# EasyEDA Pro project ProPrj_辉光管时钟V1.0_2025-10-09.epro, board PCB3
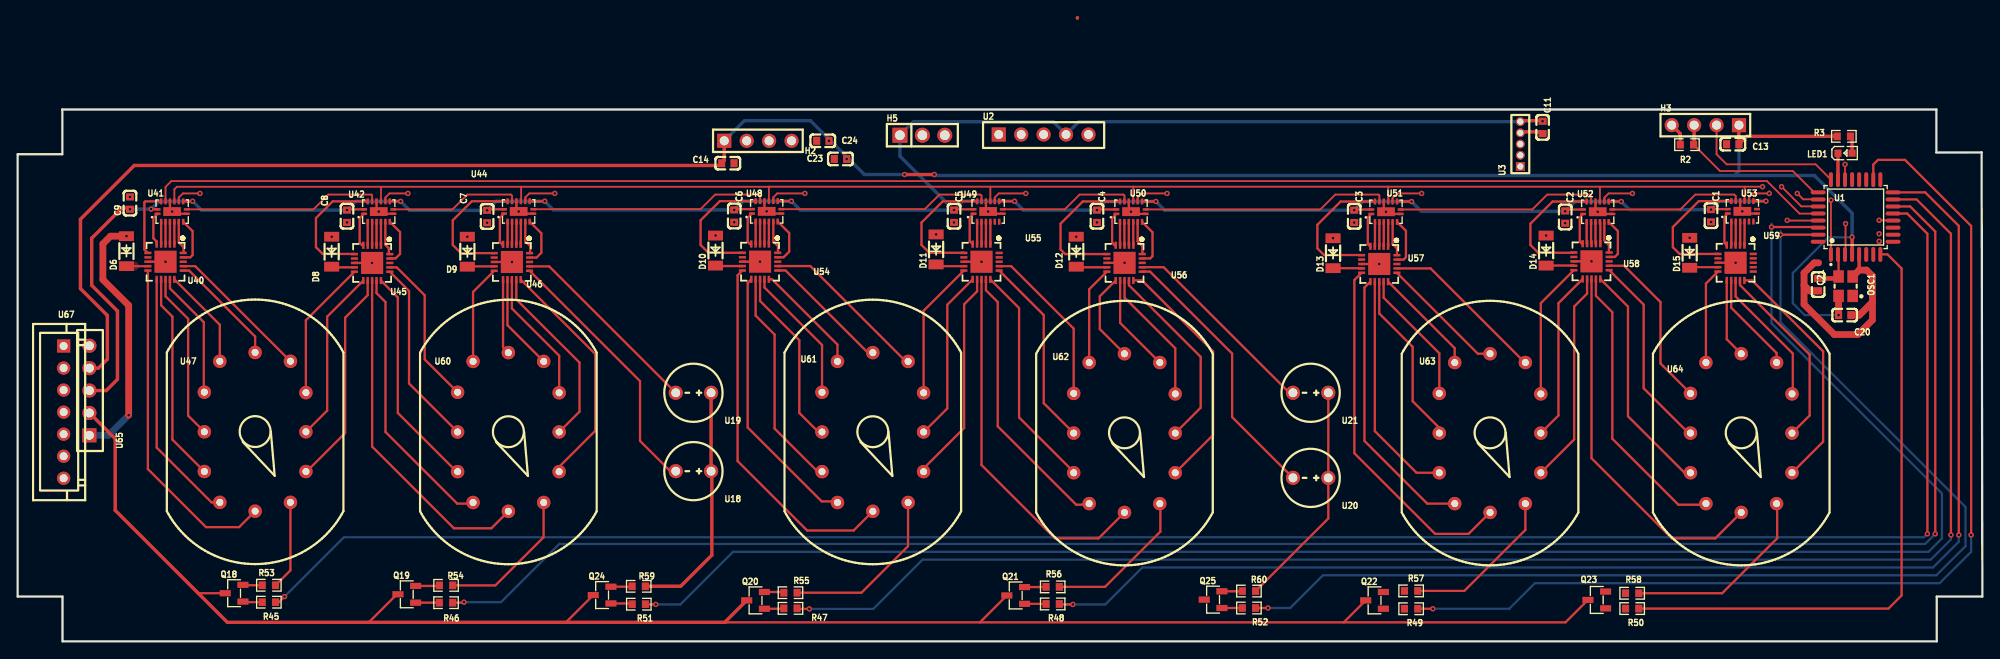
[diagram p10: board, top side]
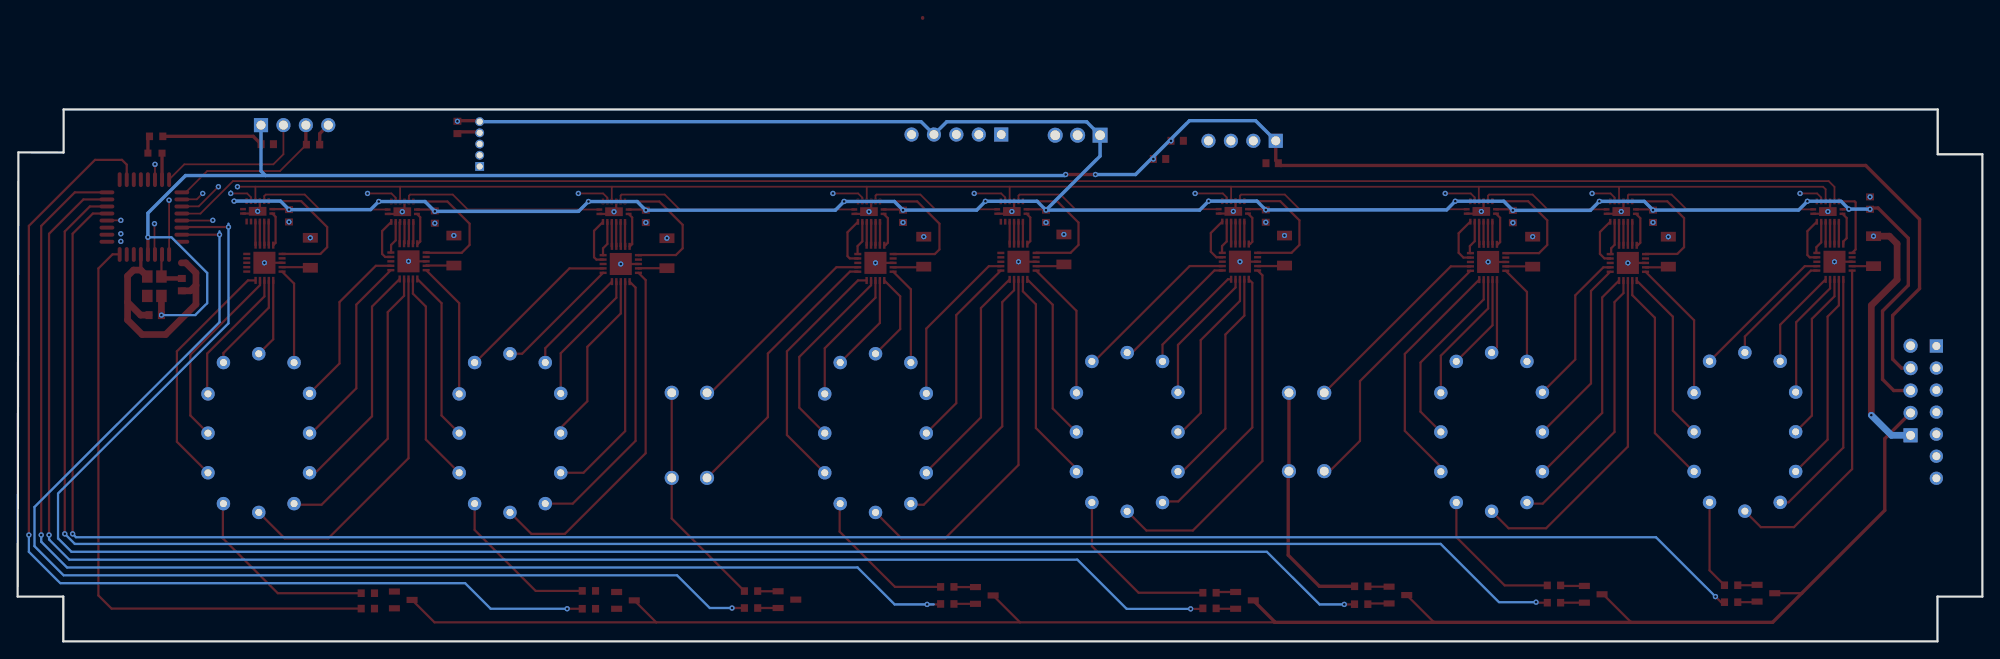
[diagram p11: board, bottom side, seen from below]

Outline 222.5 x 60.33 mm; copper layers: Top Layer, Inner1, Inner2, Bottom Layer. Coordinates in mm from the lower left corner of the outline.
Outline path: 0,55.25 0,5.08 5.08,5.08 5.08,0 217.34,0 217.34,5.08 222.5,5.08 222.42,55.45 217.3,55.44 217.3,60.33 5.05,60.33 5.05,55.25 0,55.25
Stack: Top Layer 0.035mm 外层铜厚1oz / Dielectric1 0.2104mm 7628 RC49% 8.6mil / Inner1 0.0152mm 内层铜厚 / Dielectric2 1.065mm 1.1mm H/HOZ 含铜 / Inner2 0.0152mm 内层铜厚 / Dielectric3 0.2104mm 7628 RC49% 8.6mil / Bottom Layer 0.035mm 外层铜厚1oz

## Design rules (mm)
template: JLCPCB Capability(Two Layers Board)
spacing copperThickness1oz (default): track to track 0.102, other pairs 0.152 to 0.3
spacing copperThickness2oz: track to track 0.203, other pairs 0.152 to 0.3
track width copperThickness1oz (default): min 0.127, default 0.254, max 2.54
track width copperThickness2oz: min 0.203, default 0.254, max 2.54
differential pair differentialPair (default): width min 0.127, default 0.254, max 2.54; gap min 0.152, default 0.152
via viaSize (default): diameter min 0.5, default 0.61, max 10; hole min 0.3, default 0.305, max 6.3

## Placement (name value [footprint] x y rotation side)
C1  100nF  [C0603]  191.78 48.27 270 top
C2  100nF  [C0603]  175.26 48.12 270 top
C3  100nF  [C0603]  151.37 48.2 270 top
C4  100nF  [C0603]  122.23 48.21 270 top
C5  100nF  [C0603]  106.04 48.21 270 top
C6  100nF  [C0603]  81.15 48.23 270 top
C7  100nF  [C0603]  53.17 48.18 270 top
C8  100nF  [C0603]  37.29 48.21 270 top
C9  100nF  [C0603]  12.72 49.71 90 top
C11  100nF  [C0603]  172.7 58.28 270 top
C13  100nF  [C0603]  194.24 56.39 180 top
C14  100nF  [C0603]  80.43 54.23 0 top
C20  100nF  [C0603]  206.92 37 0 top
C21  15pF  [C0603]  203.91 40.46 270 top
C23  100nF  [C0603]  93.18 54.71 0 top
C24  2.2nF  [C0603]  91.19 56.77 0 top
D6  ZMM51  [LL-34_L3.5-W1.5-RD]  12.32 44.25 90 top
D8  ZMM51  [LL-34_L3.5-W1.5-RD]  35.56 44.2 90 top
D9  ZMM51  [LL-34_L3.5-W1.5-RD]  50.93 44.2 90 top
D10  ZMM51  [LL-34_L3.5-W1.5-RD]  79.03 44.32 90 top
D11  ZMM51  [LL-34_L3.5-W1.5-RD]  104.01 44.45 90 top
D12  ZMM51  [LL-34_L3.5-W1.5-RD]  119.89 44.2 90 top
D13  ZMM51  [LL-34_L3.5-W1.5-RD]  148.97 44.02 90 top
D14  ZMM51  [LL-34_L3.5-W1.5-RD]  173.1 44.32 90 top
D15  ZMM51  [LL-34_L3.5-W1.5-RD]  189.36 44.07 90 top
H2  排针  [SIP-2.54MM-4P-CJT-H8.54]  83.83 56.77 180 top
H3  排针  [SIP-2.54MM-4P-CJT-H8.54]  191.13 58.55 0 top
H5  PZ254V-11-03P  [HDR-TH_3P-P2.54-V-M]  102.46 57.4 0 top
LED1  NCD0603R1  [LED0603-RD_RED]  206.95 55.37 0 top
OSC1  8MHz  [OSC-SMD_4P-L3.2-W2.5-BL-1]  207.02 40.28 90 top
Q18  13001  [SOT-23-3_L2.9-W1.3-P1.90-LS2.4-BR]  24.51 5.46 0 top
Q19  13001  [SOT-23-3_L2.9-W1.3-P1.90-LS2.4-BR]  44.07 5.34 0 top
Q20  13001  [SOT-23-3_L2.9-W1.3-P1.90-LS2.4-BR]  83.57 4.65 0 top
Q21  13001  [SOT-23-3_L2.9-W1.3-P1.90-LS2.4-BR]  113.03 5.21 0 top
Q22  13001  [SOT-23-3_L2.9-W1.3-P1.90-LS2.4-BR]  153.67 4.65 0 top
Q23  13001  [SOT-23-3_L2.9-W1.3-P1.90-LS2.4-BR]  178.84 4.7 0 top
Q24  13001  [SOT-23-3_L2.9-W1.3-P1.90-LS2.4-BR]  66.19 5.25 0 top
Q25  13001  [SOT-23-3_L2.9-W1.3-P1.90-LS2.4-BR]  135.38 4.73 0 top
R2  10kΩ  [r0603]  189.05 56.33 0 top
R3  220Ω  [r0603]  206.82 57.28 0 top
R45  10K  [R0603]  28.45 4.45 180 top
R46  10K  [R0603]  48.51 4.38 180 top
R47  10K  [R0603]  87.52 3.74 180 top
R48  10K  [R0603]  117.22 4.24 180 top
R49  10K  [R0603]  157.81 3.7 180 top
R50  10K  [R0603]  182.85 3.72 180 top
R51  10K  [R0603]  70.35 4.22 180 top
R52  10K  [R0603]  139.45 3.78 180 top
R53  20K  [R0603]  28.45 6.37 180 top
R54  20K  [R0603]  48.51 6.35 180 top
R55  20K  [R0603]  87.52 5.52 180 top
R56  20K  [R0603]  117.22 6.18 180 top
R57  20K  [R0603]  157.81 5.72 180 top
R58  20K  [R0603]  182.85 5.46 180 top
R59  100K  [R0603]  70.34 6.25 180 top
R60  100K  [R0603]  139.45 5.71 180 top
U1  STM32G070KBT6  [LQFP-32_L7.0-W7.0-P0.80-LS9.0-BL]  208.15 48.12 0 top
U2  -  [2.54mm1*5]  116.19 57.48 0 top
U3  FH1.27-01-5PZD  [HDR-TH_5P-P1.27-V-M]  170.18 56.4 90 top
U18  -  [6*13氖泡]  76.53 19.3 180 top
U19  -  [6*13氖泡]  76.53 28.19 180 top
U20  -  [6*13氖泡]  146.43 18.54 180 top
U21  -  [6*13氖泡]  146.43 28.19 180 top
U40  ULN2803A  [QFN-20_L4.0-W4.0-P0.50-BL-EP]  16.75 43.05 180 top
U41  74HC595BQ,115  [DHVQFN-16_L3.5-W2.5-P0.50-BL-EP]  17.5 48.74 0 top
U42  74HC595BQ,115  [DHVQFN-16_L3.5-W2.5-P0.50-BL-EP]  40.89 48.74 0 top
U44  74HC595BQ,115  [DHVQFN-16_L3.5-W2.5-P0.50-BL-EP]  56.74 48.76 0 top
U45  ULN2803A  [QFN-20_L4.0-W4.0-P0.50-BL-EP]  40.14 42.92 180 top
U46  ULN2803A  [QFN-20_L4.0-W4.0-P0.50-BL-EP]  55.97 43.03 180 top
U47  -  [IN12]  26.89 23.77 0 top
U48  74HC595BQ,115  [DHVQFN-16_L3.5-W2.5-P0.50-BL-EP]  84.83 48.77 0 top
U49  74HC595BQ,115  [DHVQFN-16_L3.5-W2.5-P0.50-BL-EP]  109.91 48.75 0 top
U50  74HC595BQ,115  [DHVQFN-16_L3.5-W2.5-P0.50-BL-EP]  126.09 48.73 0 top
U51  74HC595BQ,115  [DHVQFN-16_L3.5-W2.5-P0.50-BL-EP]  154.97 48.73 0 top
U52  74HC595BQ,115  [DHVQFN-16_L3.5-W2.5-P0.50-BL-EP]  178.94 48.73 0 top
U53  74HC595BQ,115  [DHVQFN-16_L3.5-W2.5-P0.50-BL-EP]  195.33 48.77 0 top
U54  ULN2803A  [QFN-20_L4.0-W4.0-P0.50-BL-EP]  84.08 43.06 180 top
U55  ULN2803A  [QFN-20_L4.0-W4.0-P0.50-BL-EP]  109.16 43.05 180 top
U56  ULN2803A  [QFN-20_L4.0-W4.0-P0.50-BL-EP]  125.36 42.93 180 top
U57  ULN2803A  [QFN-20_L4.0-W4.0-P0.50-BL-EP]  154.2 42.8 180 top
U58  ULN2803A  [QFN-20_L4.0-W4.0-P0.50-BL-EP]  178.24 43.1 180 top
U59  ULN2803A  [QFN-20_L4.0-W4.0-P0.50-BL-EP]  194.56 42.94 180 top
U60  -  [IN12]  55.58 23.75 0 top
U61  -  [IN12]  96.85 23.75 0 top
U62  -  [IN12]  125.35 23.62 0 top
U63  -  [IN12]  166.75 23.62 0 top
U64  -  [IN12]  195.2 23.62 0 top
U65  -  [2.54mm1*5]  8.13 28.45 90 top
U67  HX 2.54mm-7P ZZ  [CONN-TH_7P-P2.50_HX-2.54MM-7P-ZZ]  5.21 26 270 top

## Footprints (pads in the part's own frame, mm; a bottom-side part is the same pattern mirrored in y, then rotated)
2.54mm1*5
  rect 1.6x1.6 hole 1: 1(-5.08,0)
  round 1.6 hole 1: 2(-2.54,0) 3(0,0) 4(2.54,0) 5(5.08,0)
6*13氖泡
  round 1.6 hole 1: 1(-2,0) 2(2,0)
C0603
  rect 0.8x0.9 smd: 1(-0.7,0) 2(0.7,0)
CONN-TH_7P-P2.50_HX-2.54MM-7P-ZZ
  rect 1.5x1.5 hole 0.9: 1(-7.5,0)
  round 1.5 hole 0.9: 2(-5,0) 3(-2.5,0) 4(0,0) 5(2.5,0) 6(5,0) 7(7.5,0)
DHVQFN-16_L3.5-W2.5-P0.50-BL-EP
  rect 0.665x0.28 smd: 1(-1.657,-0.25) 8(1.657,-0.25) 9(1.657,0.25) 16(-1.657,0.25)
  rect 0.28x0.665 smd: 2(-1.25,-1.157) 3(-0.75,-1.157) 4(-0.25,-1.157) 5(0.25,-1.157) 6(0.75,-1.157) 7(1.25,-1.157) 10(1.25,1.157) 11(0.75,1.157) 12(0.25,1.157) 13(-0.25,1.157) 14(-0.75,1.157) 15(-1.25,1.157)
  rect 2x1 smd: 17(0,0)
HDR-TH_3P-P2.54-V-M
  rect 1.7x1.7 hole 1.1: 1(-2.54,0)
  round 1.7 hole 1.1: 2(0,0) 3(2.54,0)
HDR-TH_5P-P1.27-V-M
  rect 1x1 hole 0.7: 1(-2.54,0)
  round 1 hole 0.7: 2(-1.27,0) 3(0,0) 4(1.27,0) 5(2.54,0)
IN12
  round 1.524 hole 0.8: 0(5.75,-4.501) 1(-4,-8.001) 2(-5.75,-4.501) 3(-5.75,0) 4(-5.75,4.501) 5(-4,8.001) 6(0,8.999) 7(4,8.001) 8(5.75,4.445) 9(5.75,0) DOT(0,-8.999) HV(4,-8.001)
LED0603-RD_RED
  rect 0.8x0.8 smd: 1(-0.799,-0.004) 2(0.799,0.004)
LL-34_L3.5-W1.5-RD
  rect 1.1x1.7 smd: 1(-1.7,0) 2(1.7,0)
LQFP-32_L7.0-W7.0-P0.80-LS9.0-BL
  oval 0.448x1.684 smd: 1(-2.8,-4.242) 2(-2,-4.242) 3(-1.2,-4.242) 4(-0.4,-4.242) 5(0.4,-4.242) 6(1.2,-4.242) 7(2,-4.242) 8(2.8,-4.242) 17(2.8,4.242) 18(2,4.242) 19(1.2,4.242) 20(0.4,4.242) 21(-0.4,4.242) 22(-1.2,4.242) 23(-2,4.242) 24(-2.8,4.242)
  oval 1.684x0.448 smd: 9(4.242,-2.8) 10(4.242,-2) 11(4.242,-1.2) 12(4.242,-0.4) 13(4.242,0.4) 14(4.242,1.2) 15(4.242,2) 16(4.242,2.8) 25(-4.242,2.8) 26(-4.242,2) 27(-4.242,1.2) 28(-4.242,0.4) 29(-4.242,-0.4) 30(-4.242,-1.2) 31(-4.242,-2) 32(-4.242,-2.8)
OSC-SMD_4P-L3.2-W2.5-BL-1
  rect 1.4x1.2 smd: 1(-1.1,-0.8) 2(1.1,-0.8) 3(1.1,0.8) 4(-1.1,0.8)
QFN-20_L4.0-W4.0-P0.50-BL-EP
  rect 0.28x0.8 smd: 1(-1,-2) 2(-0.5,-2) 3(0,-2) 4(0.5,-2) 5(1,-2) 11(1,2) 12(0.5,2) 13(0,2) 14(-0.5,2) 15(-1,2)
  rect 0.8x0.28 smd: 6(2,-1) 7(2,-0.5) 8(2,0) 9(2,0.5) 10(2,1) 16(-2,1) 17(-2,0.5) 18(-2,0) 19(-2,-0.5) 20(-2,-1)
  rect 2.5x2.5 smd: 21(0,0)
R0603
  rect 0.806x0.864 smd: 1(-0.753,0) 2(0.753,0)
r0603
  rect 0.806x0.864 smd: 1(-0.753,0) 2(0.753,0)
SIP-2.54MM-4P-CJT-H8.54
  rect 1.6x1.6 hole 1.02: 1(3.81,0)
  round 1.6 hole 1.02: 2(1.27,0) 3(-1.27,0) 4(-3.81,0)
SOT-23-3_L2.9-W1.3-P1.90-LS2.4-BR
  rect 1.25x0.7 smd: 1(1,-0.95) 2(1,0.95) 3(-1,0)

## Nets
As in the schematic.

Pads without a net: OSC1 1; U40 7 18; U45 7 18; U46 7 18; U53 6 7 9; U54 7 18; U55 7 18; U56 7 18; U57 7 18; U58 7 18; U59 7 16 17 18 19 20

## Via types
v1: diameter 0.61, hole 0.305, Top Layer to Bottom Layer, 96 vias

## Routing (per net, layer and track width the routed paths; a pad name or vN(x,y) marks a point on that pad's centre or on a via; arc(x,y) is an arc through that point)
170V: length 208.6
  Top Layer w0.254: 150.18,2.16 108.98,2.16 ; 150.18,2.16 175.3,2.16 Q23.3 ; 150.18,2.16 Q22.3 ; 108.98,2.16 80.16,2.16 ; 108.98,2.16 Q21.3 ; 20.45,5.46 Q18.3 ; Q24.3 62.1,2.16 ; 42.94,5.33 39.77,2.16
  Top Layer w0.381: 8.13,25.91 11.05,22.99 11.05,14.86 23.75,2.16 80.16,2.16 80.16,2.24 Q20.3
+3.3V: length 274.8
  Top Layer w0.381: 194.92,56.13 194.92,58.52 H3.1 ; 207.75,43.89 v1(207.75,45.83) 207.77,45.85 ; U65.4 9.14,30.99 10.16,32 10.16,36.96 7.11,40.01 7.11,47.88 13.21,53.98 79.46,53.98 80.02,54.54 H2.1 ; 194.94,56.39 195.82,57.28 R3.1 ; v1(100.44,52.95) v1(103.82,52.95)
  Top Layer w0.762: v1(206.22,37) OSC1.4
  Bottom Layer w0.254: v1(207.75,45.83) 205.09,45.83 201.04,41.78 201.04,38.35 202.39,37 v1(206.22,37)
  Bottom Layer w0.381: H2.1 82.31,59.06 89.79,59.06 95.9,52.95 v1(100.44,52.95) ; 194.44,52.83 203.49,52.83 207.75,48.57 v1(207.75,45.83) ; 194.44,52.83 194.94,53.34 H3.1 ; 194.44,52.83 103.93,52.83 v1(103.82,52.95)
  vias: v1(91.89,56.77) v1(93.88,54.71)
+5V: length 335.5
  Top Layer w0.254: U51.10 v1(157.86,49.88) ; U42.16 37.38,48.99 v1(37.29,48.91) ; U41.16 15.81,49.02 v1(15.11,49.02) ; v1(191.78,48.97) 191.83,49.02 U53.16 ; v1(106.04,48.91) 106.14,49 U49.16 ; U50.10 v1(128.91,49.89) ; U48.16 81.24,49.02 v1(81.15,48.93) ; U52.16 175.47,48.98 v1(175.26,48.77) ; v1(19.81,49.91) 19.8,49.9 U41.10 ; U51.16 151.44,48.98 v1(151.37,48.9) ; U53.10 v1(197.99,49.93) ; U52.10 v1(181.61,49.88) ; U48.10 v1(87.63,49.93) ; v1(122.23,48.91) 122.31,48.98 U50.16 ; v1(53.17,48.88) 53.29,49.01 U44.16 ; U42.10 v1(43.37,49.9) ; U44.10 v1(59.69,49.92) ; U49.10 v1(112.9,49.91)
  Top Layer w0.381: v1(172.7,58.98) 172.63,59.06 170.18,59.06 ; 120.01,70.74 120.01,70.68 ; v1(12.72,49.01) 12.58,49.15 11.81,49.15 8.38,45.72 8.38,40.39 11.3,37.47 11.3,29.72 10.03,28.45 U65.3
  Bottom Layer w0.381: v1(106.04,48.91) 99.92,55.03 H5.1 ; v1(106.04,48.91) 107.04,49.91 v1(112.9,49.91) 113.9,48.91 v1(122.23,48.91) 123.21,49.89 v1(128.91,49.89) 129.9,48.9 v1(151.37,48.9) 152.35,49.88 v1(157.86,49.88) 158.98,48.77 v1(175.26,48.77) 176.38,49.88 v1(181.61,49.88) 182.53,48.97 v1(191.78,48.97) 192.74,49.93 v1(197.99,49.93) ; v1(106.04,48.91) 88.65,48.91 v1(87.63,49.93) 82.15,49.93 v1(81.15,48.93) 60.67,48.93 v1(59.69,49.92) 54.2,49.92 v1(53.17,48.88) 44.39,48.88 v1(43.37,49.9) 38.28,49.9 v1(37.29,48.91) 20.81,48.91 v1(19.81,49.91) 16,49.91 v1(15.11,49.02) 12.73,49.02 v1(12.72,49.01) ; 170.18,58.94 120.19,58.94 U2.4 117.29,58.93 101.44,58.93 H5.1 ; H5.1 99.92,57.53
GND: length 62.4
  Top Layer w0.254: U49.8 110.16,48.5 v1(109.91,48.75) 109.66,49 U49.13 ; U41.13 17.25,48.99 v1(17.5,48.74) 17.75,48.49 U41.8 ; U42.8 41.14,48.49 v1(40.89,48.74) 40.64,48.99 U42.13 ; U53.8 195.58,48.52 v1(195.33,48.77) 195.08,49.02 U53.13 ; U50.13 125.84,48.98 v1(126.09,48.73) 126.34,48.48 U50.8 ; U52.13 178.69,48.98 v1(178.94,48.73) 179.19,48.48 U52.8 ; U44.13 56.49,49.01 v1(56.74,48.76) 56.99,48.51 U44.8 ; U48.8 85.08,48.52 v1(84.83,48.77) 84.58,49.02 U48.13 ; U51.8 155.22,48.48 v1(154.97,48.73) 154.72,48.98 U51.13
  Top Layer w0.381: 170.18,57.79 172.5,57.79 C11.2 ; H3.4 188.3,57.58 R2.1 ; 208.55,42.11 208.55,43.89
  Top Layer w0.762: 202.31,40.39 202.94,39.76 C21.2 ; 202.31,40.39 202.31,38.23 205.74,34.8 208.41,34.8 210.06,36.45 210.06,38.48 ; 202.31,40.39 202.31,41.78 203.45,42.93 203.96,42.93 ; 210.06,38.48 208.58,37 C20.2 ; 210.06,38.48 210.06,41.43 209.38,42.11 208.55,42.11 OSC1.2
  vias: v1(12.72,50.41) v1(37.29,47.51) v1(53.17,47.48) v1(81.15,47.53) v1(106.04,47.51) v1(122.23,47.51) v1(151.37,47.5) v1(175.26,47.42) v1(191.78,47.57)
170_GND: length 47.1
  Top Layer w0.254: U40.8 v1(16.75,43.05) ; U46.8 v1(55.97,43.03) ; U58.8 v1(178.24,43.1) ; U56.8 U56.21 ; U59.8 v1(194.56,42.94) ; U57.8 v1(154.2,42.8) ; U45.8 v1(40.14,42.92) ; U55.8 v1(109.16,43.05) ; U54.8 v1(84.08,43.06)
  Top Layer w0.762: v1(12.57,25.65) 12.57,38.1 9.65,41.02 9.65,45.09 10.52,45.95 D6.2
  Bottom Layer w0.762: v1(12.57,25.65) 10.29,23.37 U65.1
  vias: v1(12.33,45.96) v1(35.56,45.89) v1(50.93,45.9) v1(79.04,46.03) v1(104.02,46.15) v1(119.89,45.9) v1(125.36,42.94) v1(148.98,45.73) v1(173.11,46.03) v1(189.36,45.77)
A0: length 2.7
  Top Layer w0.254: U42.2 U45.4
A1: length 3.8
  Top Layer w0.254: U41.1 15.37,48.02 15.37,45.72 15.75,45.34 U40.5
A2: length 2.5
  Top Layer w0.254: U41.2 U40.4
A3: length 2.5
  Top Layer w0.254: U41.3 U40.3
A4: length 2.5
  Top Layer w0.254: U41.4 U40.2
A5: length 2.5
  Top Layer w0.254: U41.5 U40.1
A6: length 3.8
  Top Layer w0.254: U41.6 18.25,45.25 18.8,44.7 18.8,44.1 U40.20
A7: length 5.4
  Top Layer w0.254: U41.7 19.81,46.52 19.81,43.82 19.55,43.55 U40.19
A8: length 14.6
  Top Layer w0.254: U42.15 35.68,49.9 33.78,48.01 33.78,44.7 34.54,43.94 38.12,43.94 U45.6
A9: length 4
  Top Layer w0.254: U45.5 39.03,44.92 38.73,45.21 38.73,47.99 U42.1
A_HV: length 10.1
  Top Layer w0.254: 30.89,15.76 30.89,8.06 R53.1
ADOT: length 7.8
  Top Layer w0.254: U41.15 14.46,49.9 14.35,49.79 14.35,44.45 U40.6
B0: length 2.6
  Top Layer w0.254: U44.5 56.99,45.05 U46.1
B1: length 2.7
  Top Layer w0.254: U42.4 U45.2
B2: length 2.7
  Top Layer w0.254: U42.5 U45.1
B3: length 3.9
  Top Layer w0.254: U45.20 42.04,44.03 42.04,44.58 41.64,44.97 U42.6
B4: length 5.5
  Top Layer w0.254: U45.19 42.16,43.43 42.8,43.43 43.31,43.94 43.31,46.42 U42.7
B5: length 15
  Top Layer w0.254: U44.15 51.44,49.92 49.28,47.75 49.28,44.96 50.2,44.03 U46.6
B6: length 3.9
  Top Layer w0.254: U46.5 54.86,45.03 54.61,45.28 54.61,48.04 U44.1
B7: length 2.6
  Top Layer w0.254: U44.2 55.49,45.05 U46.4
B8: length 2.6
  Top Layer w0.254: U46.3 55.99,45.05 U44.3
B9: length 2.6
  Top Layer w0.254: U44.4 56.49,45.05 U46.2
B_HV: length 16.5
  Top Layer w0.254: U60.HV 59.56,15.74 59.56,11.81 54.1,6.35 R54.1
BDOT: length 2.7
  Top Layer w0.254: U42.3 U45.3
C0: length 2.5
  Top Layer w0.254: U49.2 U55.4
C1: length 3.9
  Top Layer w0.254: U54.5 82.93,45.06 82.68,45.32 82.68,48.02 U48.1
C2: length 2.5
  Top Layer w0.254: U48.2 83.58,45.06
C3: length 2.5
  Top Layer w0.254: U48.3 U54.3
C4: length 2.5
  Top Layer w0.254: U48.4 84.58,45.06
C5: length 2.5
  Top Layer w0.254: U48.5 U54.1
C6: length 3.8
  Top Layer w0.254: U48.6 85.58,45.36 86.11,44.83 86.11,44.09 U54.20
C7: length 5.5
  Top Layer w0.254: U54.19 86.08,43.56 86.74,43.56 87.38,44.2 87.38,46.31 U48.7
C8: length 15
  Top Layer w0.254: U55.6 107.14,44.07 103.25,44.07 102.36,44.96 102.36,47.5 104.77,49.91 U49.15
C9: length 3.8
  Top Layer w0.254: U49.1 107.82,48.07 107.82,45.39 U55.5
C_HV: length 19.7
  Top Layer w0.254: R55.1 95.56,5.52 100.84,10.8 100.84,15.74 U61.HV
CDOT: length 15
  Top Layer w0.254: U48.15 79.52,49.93 77.34,47.75 77.34,44.96 78.23,44.07 82.07,44.07 U54.6
CLK: length 217.4
  Top Layer w0.203: U48.11 85.58,50.36 86.02,50.8 v1(89.15,50.8) ; v1(44.2,50.8) 42.11,50.8 41.64,50.34 U42.11 ; U49.11 110.66,50.34 111.12,50.8 v1(114.17,50.8) ; U41.11 18.25,50.34 18.71,50.8 v1(20.65,50.8) ; 203.91,50.14 202.21,50.14 v1(201.55,50.8) ; U51.11 155.72,50.32 156.2,50.8 v1(159,50.8) ; U52.11 179.69,50.32 180.18,50.8 v1(182.88,50.8) ; v1(60.83,50.8) 57.94,50.8 57.49,50.35 U44.11 ; v1(198.37,50.8) 196.51,50.8 196.08,50.36 U53.11 ; v1(130.17,50.8) 127.32,50.8 126.84,50.33 U50.11
  Inner2 w0.203: 60.83,51.05 195.33,51.05 195.58,50.8 v1(198.37,50.8) v1(201.55,50.8) ; v1(20.65,50.8) 20.9,51.05 43.94,51.05 v1(44.2,50.8) 44.45,51.05 60.58,51.05 v1(60.83,50.8)
  Bottom Layer w0.203: 198.37,51.05 v1(198.37,50.8)
COLON1: length 198.9
  Top Layer w0.254: v1(72.26,4.19) 71.13,4.19 R51.1 ; v1(198.63,46.99) 203.84,46.99 U1.30
  Bottom Layer w0.254: 198.63,47.37 v1(198.63,46.99) 198.63,36.07 217.93,16.76 217.93,11.68 216.41,10.16 81.03,10.16 75.06,4.19 v1(72.26,4.19)
COLON2: length 132
  Top Layer w0.254: U1.31 v1(199.64,46.12) ; R52.1 v1(141.6,3.78)
  Bottom Layer w0.254: 199.64,46.5 v1(199.64,46.12) 199.64,36.2 220.6,15.24 220.6,10.8 217.3,7.49 147.83,7.49 144.12,3.78 v1(141.6,3.78)
CS: length 201
  Top Layer w0.203: 155.19,51.56 155.22,51.54 U51.12 ; 155.19,51.56 126.34,51.56 ; 155.19,51.56 179.19,51.56 ; 85.09,51.56 57.02,51.56 ; 85.09,51.56 85.08,51.55 85.08,50.05 ; 85.09,51.56 85.09,51.56 110.16,51.56 ; 57.02,51.56 18.03,51.56 17.75,51.28 17.75,50.03 ; 57.02,51.56 57.02,50.08 56.99,50.04 ; v1(199.77,51.56) 202,49.34 203.91,49.34 ; 195.58,51.56 195.58,49.93 U53.12 ; 195.58,51.56 179.19,51.56 ; 195.58,51.56 v1(197.61,51.56) ; 41.15,51.44 41.14,51.43 U42.12 ; 126.34,51.56 110.16,51.56 ; 126.34,51.56 126.34,50.02 ; 110.16,51.56 110.16,50.04 ; 179.19,51.56 179.19,50.01
  Inner2 w0.203: v1(199.77,51.56) v1(197.61,51.56)
D0: length 2.6
  Top Layer w0.254: 126.36,44.94 126.34,44.95 U50.5
D1: length 2.5
  Top Layer w0.254: U49.4 U55.2
D2: length 2.5
  Top Layer w0.254: U49.5 U55.1
D5: length 16.2
  Top Layer w0.254: U50.15 120.63,49.89 118.11,47.37 118.11,44.45 118.63,43.93 U56.6
D6: length 4
  Top Layer w0.254: U50.1 123.95,48 123.95,45.21 124.23,44.94 124.36,44.94
D7: length 2.6
  Top Layer w0.254: U50.2 124.84,44.95 124.86,44.94
D8: length 2.6
  Top Layer w0.254: 125.36,44.94 125.34,44.95 U50.3
D9: length 2.6
  Top Layer w0.254: 125.86,44.94 125.84,44.95 U50.4
D_HV: length 17.2
  Top Layer w0.254: U62.HV 129.41,15.56 129.41,12.45 123.15,6.18 R56.1
DDOT: length 2.5
  Top Layer w0.254: U49.3 U55.3
DS3231: length 3.5
  Top Layer w0.203: U1.29 200.44,47.72 v1(200.41,47.75)
E0: length 2.5
  Top Layer w0.254: U58.4 177.69,45.15 U52.2
E1: length 4
  Top Layer w0.254: U57.5 153.16,44.8 152.91,45.05 152.91,48.07 U51.1
E2: length 2.8
  Top Layer w0.254: U57.4 153.72,44.82 U51.2
E3: length 2.8
  Top Layer w0.254: U51.3 154.22,44.82 U57.3
E4: length 2.8
  Top Layer w0.254: U51.4 154.72,44.82 U57.2
E5: length 2.8
  Top Layer w0.254: U51.5 155.22,44.82 U57.1
E6: length 4
  Top Layer w0.254: U51.6 155.72,45.07 156.21,44.58 156.21,43.81 U57.20
E7: length 5.6
  Top Layer w0.254: U51.7 157.23,46.56 157.23,43.56 156.96,43.3 U57.19
E8: length 15.1
  Top Layer w0.254: U58.6 176.21,44.07 172.21,44.07 171.32,44.96 171.32,47.37 173.84,49.88 U52.15
E9: length 3.7
  Top Layer w0.254: U58.5 177.16,45.1 176.91,45.35 176.91,48.1 U52.1
E_HV: length 18
  Top Layer w0.254: U63.HV 170.75,12.64 163.84,5.72 R57.1
EDOT: length 15.6
  Top Layer w0.254: U51.15 149.83,49.88 147.19,47.24 147.19,44.58 147.95,43.82 152.19,43.82 U57.6
F0: length 2.7
  Top Layer w0.254: U53.5 195.58,44.96 U59.1
F1: length 2.5
  Top Layer w0.254: U52.4 178.69,45.15 U58.2
F2: length 2.5
  Top Layer w0.254: U52.5 179.24,47.52 U58.1
F3: length 3.7
  Top Layer w0.254: U58.20 180.21,44.13 180.21,44.96 179.69,45.48 U52.6
F4: length 5.2
  Top Layer w0.254: U52.7 181.23,46.53 181.23,43.94 180.89,43.6 U58.19
F5: length 15.6
  Top Layer w0.254: U53.15 190.39,49.93 187.45,46.99 187.45,44.7 188.21,43.94 192.56,43.94 U59.6
F6: length 3.9
  Top Layer w0.254: U59.5 193.55,44.94 193.29,45.19 193.29,48.15 U53.1
F7: length 2.7
  Top Layer w0.254: U59.4 194.08,44.96 U53.2
F8: length 2.7
  Top Layer w0.254: U53.3 194.58,44.96 U59.3
F9: length 2.7
  Top Layer w0.254: U59.2 195.08,44.96 U53.4
F_HV: length 22.2
  Top Layer w0.254: U64.HV 199.26,15.56 199.26,11.68 193.04,5.46 R58.1
FDOT: length 2.5
  Top Layer w0.254: U58.3 178.19,45.15 U52.3
G0: length 3.8
  Top Layer w0.254: U44.6 57.49,45.38 58.04,44.83 58.04,44.1 U46.20
G1: length 5.6
  Top Layer w0.254: U44.7 59.31,46.28 59.31,44.07 58.77,43.53 U46.19
G_HV: length 27.4
  Top Layer w0.381: U19.1 U18.1 78.61,19.22 78.61,9.78 75.08,6.25 R59.1
H0: length 3.9
  Top Layer w0.254: U50.6 126.84,45.37 127.38,44.83 127.38,43.96 127.36,43.94
H1: length 5.7
  Top Layer w0.254: 127.36,43.44 127.36,43.43 128.27,43.43 128.52,43.69 128.52,46.39 U50.7
H_HV: length 25.9
  Top Layer w0.254: R60.1 148.43,13.94 U20.1 U21.1
INFRARED-RAY: length 1.7
  Top Layer w0.203: U1.22 v1(206.95,54.1)
LED: length 3
  Top Layer w0.381: LED1.1 206.15,52.38
MOSI: length 190.6
  Top Layer w0.203: U41.14 16.75,51.55 17.4,52.2 198.12,52.2 201.8,48.51 203.89,48.51 203.91,48.54
NIX_A0: length 24.6
  Top Layer w0.254: U45.12 39.64,39.26 37.08,36.7 37.08,23.62 32.73,19.26 U47.0
NIX_A1: length 28.8
  Top Layer w0.254: U47.1 21.95,15.76 15.75,21.97 U40.11
NIX_A2: length 23.8
  Top Layer w0.254: U40.12 16.25,38.11 17.53,36.83 17.53,22.88 U47.2
NIX_A3: length 19.1
  Top Layer w0.254: U40.13 16.75,39.13 19.3,36.58 19.3,25.6 U47.3
NIX_A4: length 14.4
  Top Layer w0.254: 21.14,28.27 21.08,28.33 21.08,36.2 17.25,40.03 U40.14
NIX_A5: length 11.4
  Top Layer w0.254: 22.89,31.77 22.89,35.91 U40.15
NIX_A6: length 13.1
  Top Layer w0.254: U40.16 19.41,42.05 26.89,34.57 U47.6
NIX_A7: length 16.6
  Top Layer w0.254: U40.17 20.11,42.55 30.89,31.77
NIX_A8: length 16
  Top Layer w0.254: U47.8 32.64,36.42 U45.10
NIX_A9: length 19.8
  Top Layer w0.254: U45.11 35.05,36.83 35.05,26.17 U47.9
NIX_ADOT: length 38.1
  Top Layer w0.254: U40.10 14.75,19.54 21.34,12.95 25.08,12.95 26.89,14.77
NIX_B0: length 27
  Top Layer w0.254: U60.0 61.33,19.8 65.41,23.88 65.41,32.6 U46.15
NIX_B1: length 30.9
  Top Layer w0.254: U45.14 40.64,39.49 41.66,38.48 41.66,23.75 49.78,15.62 51.45,15.62 U60.1
NIX_B2: length 25.3
  Top Layer w0.254: U60.2 49.71,19.25 43.05,25.91 43.05,39.01 U45.15
NIX_B3: length 21.4
  Top Layer w0.254: U45.16 44.32,39.74 44.32,29.25 U60.3
NIX_B4: length 17.8
  Top Layer w0.254: U60.4 46.1,31.97 46.1,39.24 42.92,42.42 U45.17
NIX_B5: length 11.3
  Top Layer w0.254: U60.5 51.57,39.63 U46.10
NIX_B6: length 8.5
  Top Layer w0.254: U46.11 54.97,33.35 U60.6
NIX_B7: length 11
  Top Layer w0.254: U60.7 55.47,35.85 U46.12
NIX_B8: length 15.1
  Top Layer w0.254: U46.13 55.97,37.75 61.33,32.4 U60.8
NIX_B9: length 21.2
  Top Layer w0.254: U46.14 56.47,38.78 63.63,31.62 63.63,26.05 U60.9
NIX_BDOT: length 38.9
  Top Layer w0.254: U45.13 40.14,22.09 49.4,12.83 53.65,12.83 U60.DOT
NIX_C0: length 24.3
  Top Layer w0.254: U61.0 102.6,19.61 107.19,24.2 107.19,38.23 108.66,39.7 U55.12
NIX_C1: length 30.7
  Top Layer w0.254: U61.1 92.72,15.88 91.06,15.88 82.68,24.26 82.68,40.66 U54.11
NIX_C2: length 25.2
  Top Layer w0.254: U61.2 90.61,19.25 85.72,24.13 85.72,34.8 83.58,36.95 U54.12
NIX_C3: length 20.5
  Top Layer w0.254: U61.3 90.68,23.75 88.52,25.91 88.52,34.16 84.08,38.6 U54.13
NIX_C4: length 15.5
  Top Layer w0.254: U54.14 84.58,40.14 91.1,33.62 U61.4
NIX_C5: length 12.7
  Top Layer w0.254: U54.15 85.44,41.06 92.85,33.65 U61.5
NIX_C6: length 14.6
  Top Layer w0.254: U61.6 96.28,32.75 86.97,42.06 U54.16
NIX_C7: length 19.2
  Top Layer w0.254: U61.7 100.58,31.75 89.77,42.56 U54.17
NIX_C8: length 15.7
  Top Layer w0.254: U55.10 102.6,37.49 U61.8
NIX_C9: length 19.6
  Top Layer w0.254: U55.11 105.28,38.18 105.28,26.42 102.62,23.75 U61.9
NIX_CDOT: length 41.3
  Top Layer w0.254: U54.10 81.53,41.52 81.53,20.45 89.41,12.57 94.67,12.57 U61.DOT
NIX_D0: length 27.9
  Top Layer w0.254: U62.0 135.38,23.4 135.38,32.89 127.34,40.94 126.36,40.94
NIX_D1: length 31.3
  Top Layer w0.254: U55.14 109.66,39.82 111,38.48 111,24.38 119.89,15.49 121.22,15.49 U62.1
NIX_D2: length 25.8
  Top Layer w0.254: U62.2 119.6,19.21 113.41,25.4 113.41,37.8 U55.15
NIX_D3: length 21.9
  Top Layer w0.254: U55.16 116.2,37.01 116.2,27.02 U62.3
NIX_D4: length 18.7
  Top Layer w0.254: U62.4 119.6,35.47 112.51,42.55 U55.17
NIX_D5: length 11.1
  Top Layer w0.254: 123.36,41.94 121.35,39.93 U62.5
NIX_D6: length 10.2
  Top Layer w0.254: 124.36,40.94 122.56,39.13 122.56,35.42 U62.6
NIX_D7: length 11.2
  Top Layer w0.254: 124.86,40.94 124.86,36.12 U62.7
NIX_D8: length 15.2
  Top Layer w0.254: U62.8 131.1,33.24 125.36,38.98 125.36,40.94
NIX_D9: length 21.9
  Top Layer w0.254: 125.86,40.94 125.86,40.39 133.98,32.26 133.98,26.51 U62.9
NIX_DDOT: length 41.9
  Top Layer w0.254: U55.13 109.16,20 117.47,11.68 122.41,11.68 U62.DOT
NIX_E0: length 24.1
  Top Layer w0.254: U58.12 177.74,39.44 176.28,37.97 176.28,22.9 U63.0
NIX_E1: length 31.5
  Top Layer w0.254: U57.11 152.53,40.13 152.53,22.73 159.64,15.62 U63.1
NIX_E2: length 26.2
  Top Layer w0.254: U57.12 153.7,23.85 158.42,19.12 U63.2
NIX_E3: length 20
  Top Layer w0.254: U57.13 154.2,37.19 157.99,33.4 157.99,27.23 161,24.22 U63.3
NIX_E4: length 15.3
  Top Layer w0.254: U63.4 161,32.67 154.7,38.97 U57.14
NIX_E5: length 12.3
  Top Layer w0.254: U57.15 162.75,33.25 U63.5
NIX_E6: length 14.4
  Top Layer w0.254: U57.16 156.2,41.79 165.37,32.62 U63.6
NIX_E7: length 19
  Top Layer w0.254: U63.7 170.69,31.62 160.01,42.3 U57.17
NIX_E8: length 15.6
  Top Layer w0.254: U63.8 172.5,38.36 U58.10
NIX_E9: length 19.4
  Top Layer w0.254: U63.9 174.5,25.62 174.5,38.36 U58.11
NIX_EDOT: length 41
  Top Layer w0.254: U57.10 151.38,40.98 151.38,21.34 160.53,12.19 164.32,12.19 U63.DOT
NIX_F0: length 27.5
  Top Layer w0.254: U59.15 196.42,40.94 204.47,32.89 204.47,22.64 U64.0
NIX_F1: length 32.6
  Top Layer w0.254: U64.1 191.07,15.49 188.09,15.49 180.59,22.99 180.59,37.34 178.74,39.19 U58.14
NIX_F2: length 26.6
  Top Layer w0.254: U58.15 182.37,37.97 182.37,25.53 188.78,19.12 U64.2
NIX_F3: length 22.4
  Top Layer w0.254: U64.3 189.23,23.62 184.15,28.7 184.15,38.19 U58.16
NIX_F4: length 19.3
  Top Layer w0.254: U64.4 186.06,31.52 186.06,38.48 181.94,42.6 U58.17
NIX_F5: length 10.9
  Top Layer w0.254: U64.5 191.2,40.58 U59.10
NIX_F6: length 9
  Top Layer w0.254: U64.6 193.56,34.26 U59.11
NIX_F7: length 11.4
  Top Layer w0.254: U59.12 194.06,37.84 199.2,32.7 U64.7
NIX_F8: length 15.6
  Top Layer w0.254: U64.8 201.04,28.16 201.04,32.64 194.56,39.12 U59.13
NIX_F9: length 21.4
  Top Layer w0.254: U59.14 195.06,40.4 202.95,32.51 202.95,25.62 U64.9
NIX_FDOT: length 42.3
  Top Layer w0.254: U64.DOT 192.26,11.68 187.32,11.68 178.24,20.77 U58.13
NIX_G0: length 29.9
  Top Layer w0.254: U46.16 70.48,29.52 70.48,22.73 73.91,19.3 U18.2
NIX_G1: length 22.5
  Top Layer w0.254: U19.2 60.19,42.53 U46.17
NIX_H0: length 31
  Top Layer w0.254: U20.2 137.54,25.43 137.54,32.64 128.24,41.94 127.36,41.94
NIX_H1: length 23
  Top Layer w0.254: 127.36,42.44 129.78,42.44 144.02,28.19 U21.2
OSC_IN: length 4.9
  Top Layer w0.254: OSC1.3 206.22,43.82 206.15,43.89
  Top Layer w0.508: OSC1.3 206,41.16 C21.1
RADER: length 42.9
  Top Layer w0.203: 206.95,43.89 207.01,43.95 v1(207.01,47.37)
  Inner2 w0.203: 206.88,47.37 200.39,53.86 U3.1
RADER_RX: length 43.7
  Top Layer w0.203: v1(205.36,50.04) 205.35,50.03 205.35,43.89
  Inner2 w0.203: U3.2 200.65,55.13 205.36,50.42 v1(205.36,50.04)
  vias: v1(210.82,46.23) v1(210.82,45.37)
RADER_TX: length 45.9
  Top Layer w0.203: 212.4,47.74 212.38,47.75 v1(210.82,47.75)
  Inner2 w0.203: v1(210.82,47.75) 209.55,47.75 200.79,56.52 170.29,56.52 U3.3
SWCLK: length 18.6
  Top Layer w0.203: 203.91,50.94 203.45,50.94 201.04,53.34 192.8,53.34 R2.2
  Top Layer w0.381: R2.2 189.87,56.4 H3.3
SWDIO: length 17.4
  Top Layer w0.203: 205.35,52.38 203.63,54.1 193.55,54.1 192.41,55.25 H3.2
SWITCH1: length 229.2
  Top Layer w0.254: v1(216.28,12.19) 216.28,46.23 213.99,48.52 212.4,48.52 ; v1(30.23,5.08) 29.59,4.45 R45.1
  Bottom Layer w0.254: v1(216.28,12.19) 215.9,11.81 36.96,11.81 v1(30.23,5.08)
SWITCH2: length 211.4
  Top Layer w0.254: R46.1 50.48,4.38 v1(50.55,4.45) ; v1(217.17,12.19) 217.17,46.48 214.33,49.32 U1.14
  Bottom Layer w0.254: v1(50.55,4.45) 54.74,4.45 61.34,11.05 216.03,11.05 v1(217.17,12.19)
SWITCH3: length 176.9
  Top Layer w0.254: v1(89.66,3.68) 88.34,3.68 R47.1 ; v1(218.95,12.07) 218.95,46.23 215.05,50.12 U1.15
  Bottom Layer w0.254: v1(89.66,3.68) 96.9,3.68 102.49,9.27 216.66,9.27 218.95,11.56 218.95,12.19
SWITCH4: length 150.6
  Top Layer w0.254: U1.16 216.03,50.92 219.84,47.12 v1(219.84,12.07) ; v1(119.51,4.19) 118.03,4.19 R48.1
  Bottom Layer w0.254: 118.75,4.19 v1(119.51,4.19) 123.19,4.19 127.38,8.38 216.92,8.38 219.84,11.3 v1(219.84,12.07) 219.84,12.19
SWITCH5: length 118.4
  Top Layer w0.254: v1(221.23,12.07) 221.23,47.12 213.74,54.61 210.69,54.61 210.15,54.07 U1.18 ; R49.1 v1(160.27,3.7)
  Bottom Layer w0.254: v1(221.23,12.07) 221.23,10.16 217.68,6.6 171.83,6.6 168.92,3.7 v1(160.27,3.7)
SWITCH6: length 70.5
  Top Layer w0.254: 210.95,43.89 211.76,43.89 213.36,42.29 213.36,5.21 211.87,3.72 R50.1
$1N6169: length 2.2
  Top Layer w0.254: R45.2 25.58,4.45 Q18.1
$1N6235: length 2.7
  Top Layer w0.254: Q19.1 47.76,4.39 R46.2
$1N6302: length 2.2
  Top Layer w0.254: R47.2 86.72,3.7 84.57,3.7
$1N6369: length 2.4
  Top Layer w0.254: R48.2 116.45,4.26 Q21.1
$1N6570: length 2.4
  Top Layer w0.254: R51.2 69.51,4.3 Q24.1
$1N6637: length 2.3
  Top Layer w0.254: Q25.1 R52.2
$1N6665: length 2.2
  Top Layer w0.254: R53.2 25.56,6.37 Q18.2
$1N6836: length 2.7
  Top Layer w0.254: Q19.2 47.7,6.29 R54.2
$1N6839: length 2.2
  Top Layer w0.254: 84.57,5.6 86.69,5.6 R55.2
$1N6842: length 2.4
  Top Layer w0.254: Q21.2 116.44,6.16 R56.2
$1N6845: length 2.3
  Top Layer w0.254: R60.2 138.67,5.68 Q25.2
$1N6848: length 2.4
  Top Layer w0.254: R59.2 69.54,6.2 Q24.2
$1N7281: length 22.4
  Top Layer w0.203: U41.9 33.5,48.99 35.18,50.67 40.05,50.67 40.14,50.58 U42.14
$1N7409: length 14.8
  Top Layer w0.203: U42.9 49.25,48.99 50.93,50.67 55.86,50.67 55.99,50.54 U44.14
$1N7662: length 2.5
  Top Layer w0.254: 12.38,42.55 D6.1 ; 12.38,42.55 12.32,42.5 ; 12.38,42.55 U40.9
$1N7759: length 2.6
  Top Layer w0.254: D8.1 35.64,42.42 U45.9
$1N7768: length 3.1
  Top Layer w0.254: D9.1 50.96,42.53 U46.9
$1N10205: length 3.1
  Top Layer w0.254: U54.9 79.09,42.56 D10.1
$1N10207: length 3.2
  Top Layer w0.254: U55.9 104.21,42.55 D11.1
$1N10209: length 3.5
  Top Layer w0.254: D12.1 119.96,42.43 U56.9
$1N10723: length 3.2
  Top Layer w0.254: U57.9 152.18,42.32 D13.1
$1N10725: length 3.1
  Top Layer w0.254: U58.9 176.22,42.62 D14.1
$1N10727: length 3.2
  Top Layer w0.254: D15.1 189.43,42.44 U59.9
$1N12092: length 27
  Top Layer w0.203: U48.14 84.07,49.93 84.07,50.55 83.95,50.67 78.99,50.67 77.33,49.01 U44.9
$1N12107: length 24.1
  Top Layer w0.203: U49.14 109.16,50.55 109.03,50.67 104.39,50.67 102.74,49.02 U48.9
$1N12114: length 15.2
  Top Layer w0.203: U49.9 118.6,49 120.27,50.67 125.23,50.67 125.35,50.56 125.35,49.9 U50.14
$1N12123: length 27.9
  Top Layer w0.203: U51.14 154.22,50.57 154.11,50.67 149.22,50.67 147.54,48.98 U50.9
$1N12132: length 23
  Top Layer w0.203: U51.9 171.53,48.98 173.23,50.67 178.05,50.67 178.19,50.53 U52.14
$1N12137: length 15.3
  Top Layer w0.203: U52.9 188.29,48.98 189.99,50.67 194.41,50.67 194.58,50.51 U53.14
$2N1508: length 2
  Top Layer w0.381: 207.75,55.38 207.75,57.1 207.57,57.28

## Copper pours and planes (outline as drawn; the poured copper is in the pictures)
170_GND on Bottom Layer: 10.16,41.02 67.69,41.02 69.6,42.93 73.41,42.93 75.56,40.77 196.22,40.77 196.98,41.53 196.98,46.36 196.98,46.48 10.16,46.48

Small or netless copper shapes (teardrops, artwork), in the pictures only: 1 on Top Layer
